# EAGLE design SW4B_QWIIC (EAGLE 9.6.2)
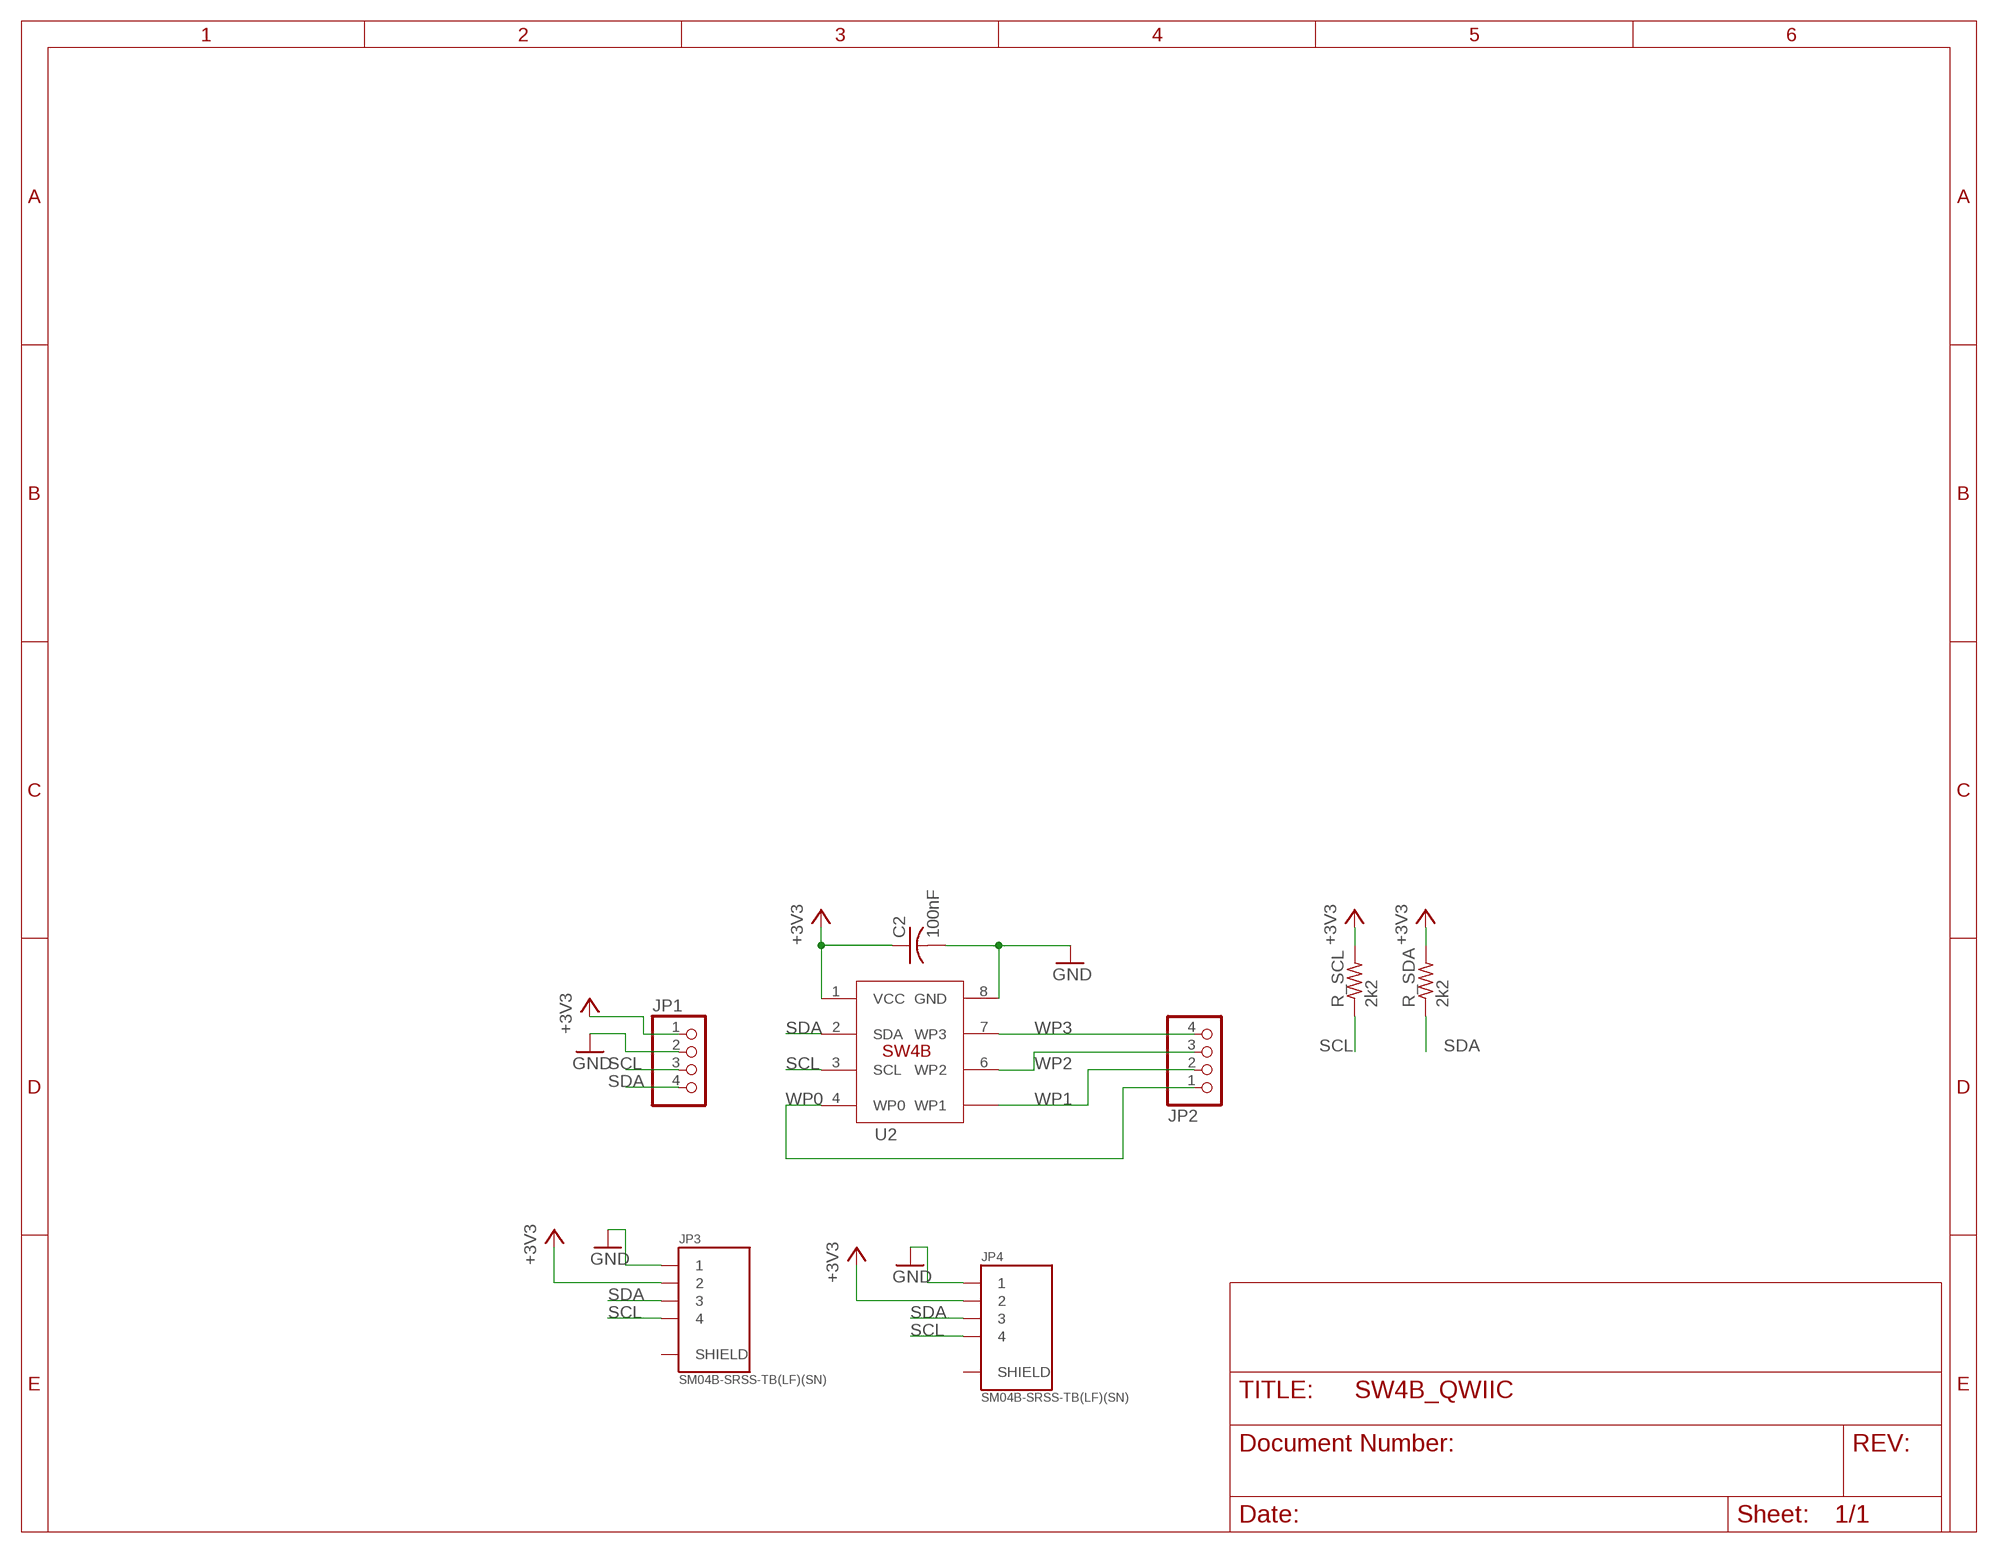
[diagram p0: schematic, sheet 1]

## Parts
C2  100nF  C-USC0603  [C0603]
JP1  PINHD-1X4  [1X04]
JP2  PINHD-1X4  [1X04]
JP3  SM04B-SRSS-TB(LF)(SN)  [JST_SM04B-SRSS-TB(LF)(SN)]
JP4  SM04B-SRSS-TB(LF)(SN)  [JST_SM04B-SRSS-TB(LF)(SN)]
R_SCL  2k2  R-US_R0603  [R0603]
R_SDA  2k2  R-US_R0603  [R0603]
U2  SERIALWOMBAT_4BSOCKETDIP  [SW4B_SOCKET]

## Nets
+3V3: C2.1 JP1.1 JP3.2 JP4.2 R_SCL.2 R_SDA.2 U2.1(VCC)
GND: C2.2 JP1.2 JP3.1 JP4.1 U2.8(GND)
SCL: JP1.3 JP3.4 JP4.4 R_SCL.1 U2.3(SCL)
SDA: JP1.4 JP3.3 JP4.3 R_SDA.1 U2.2(SDA)
WP0: JP2.1 U2.4(WP0)
WP1: JP2.2 U2.5(WP1)
WP2: JP2.3 U2.6(WP2)
WP3: JP2.4 U2.7(WP3)
Unconnected: JP3.S1(SHIELD) JP3.S2(SHIELD) JP4.S1(SHIELD) JP4.S2(SHIELD)

## Library data of the parts
C2 = rcl:C-US: CAPACITOR, American symbol; SPICEPREFIX: C
JP1 JP2 = pinhead:PINHD-1X4: PIN HEADER
JP3 JP4 = SerialWombat_F360_Library:SM04B-SRSS-TB(LF)(SN): SH Series 1.0 mm Pitch 2 Position Single Row Side Entry Shrouded Header; MANUFACTURER: JST; STANDARD: Manufacturer recommendations
R_SCL R_SDA = rcl:R-US_: RESISTOR, American symbol; SPICEPREFIX: R
U2 = SerialWombat_F360_Library:SERIALWOMBAT_4B

## Board
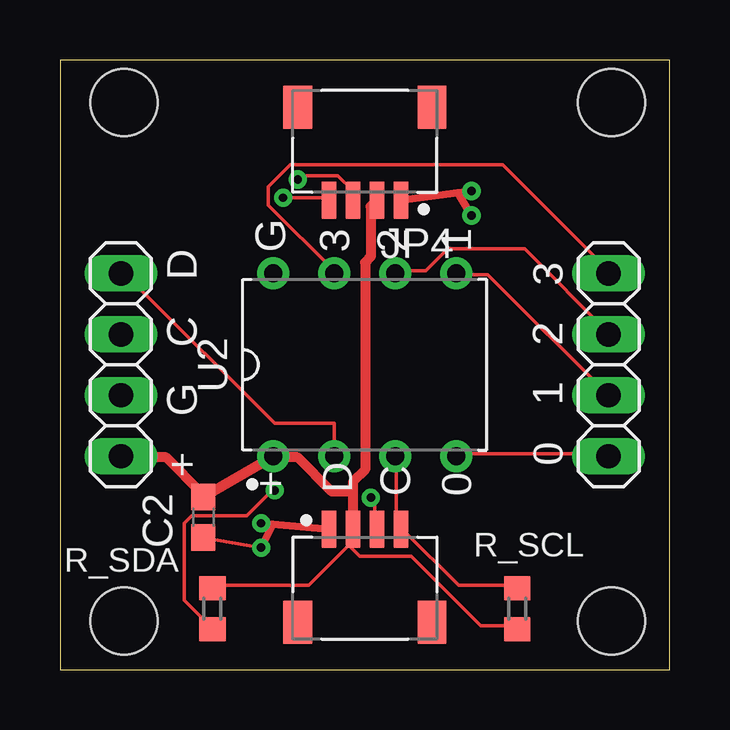
[diagram p1: board, top side]
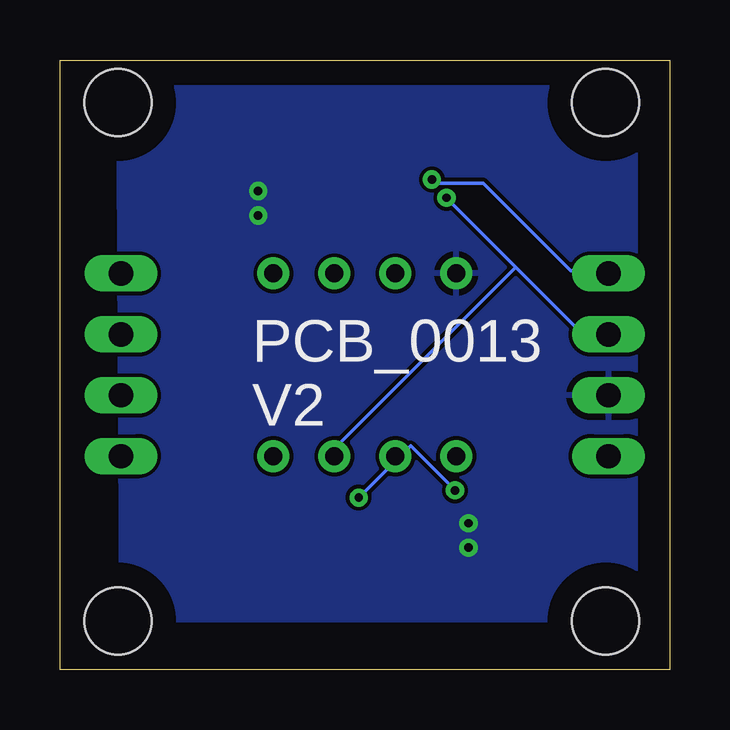
[diagram p2: board, bottom side, seen from below]

Size 25.4 x 25.4 mm. Coordinates in mm from the lower left corner, seen from the top.
Outline: 0,0 25.4,0 25.4,25.4 0,25.4 0,0
Copper layers (1*16): Top 0.035mm / dielectric 1.5mm / Bottom 0.035mm
Design rules "default": minimum track width 6mil, minimum drill 0.35mm, track to track 6mil, track to pad 6mil, pad to pad 6mil, via to via 6mil, smd to smd 6mil, copper to edge 40mil, drill to drill 6mil, minimum pad ring 10mil, minimum via ring 8mil, stop-mask expansion 4mil, vias tented up to drill 0mil, thermal gap 10mil
Holes 2.79 mm at 2.67,23.62 22.99,23.62 22.99,2.03 2.67,2.03

### Footprints (pad centres in the part's own frame; a part is rotated, then mirrored left to right if it is on the bottom)
C0603 = smd 1.1 x 1: 1 -0.85,0; 2 0.85,0
1X04 = drill 1.016 long: 1 -3.81,0; 2 -1.27,0; 3 1.27,0; 4 3.81,0
JST_SM04B-SRSS-TB(LF)(SN) = smd 0.6 x 1.55: 1 -1.5,0; 2 -0.5,0; 3 0.5,0; 4 1.5,0 | smd 1.2 x 1.8: S1 -2.8,-3.875; S2 2.8,-3.875
R0603 = smd 1 x 1.1: 1 -0.85,0; 2 0.85,0
SW4B_SOCKET = drill 0.743 pad 1.343: 1 -3.81,3.81; 2 -3.81,1.27; 3 -3.81,-1.27; 4 -3.81,-3.81; 5 3.81,-3.81; 6 3.81,-1.27; 7 3.81,1.27; 8 3.81,3.81

### Placement (x,y rotation side)
C2  5.97,6.35 270 top
JP1  2.54,12.7 90 top
JP2  22.86,12.7 90 top
JP3  12.7,5.84 0 top
JP4  12.7,19.56 180 top
R_SCL  19.05,2.54 270 top
R_SDA  6.35,2.54 90 top
U2  12.7,12.7 90 top

### Tracks (layer width: path | path; a pad name or v marks a point on that pad's centre or on a via)
+3V3
  Top 0.152: 2.59,8.84 JP1.1 | 5.94,7.32 C2.1 | 12.04,5.18 10.36,3.5 6.4,3.5 R_SDA.2 | 12.04,5.18 12.04,5.79 JP3.2 12.04,5.18 | 12.04,5.18 12.5,4.72 14.63,4.72 17.53,1.83 19.05,1.83 R_SCL.2 | 8.99,8.84 U2.1
  Top 0.406: JP4.2 12.95,19.3 12.95,17.19 12.71,16.96 12.71,8.34 12.2,7.83 12.2,7.42 | 12.2,7.42 JP3.2 | C2.1 U2.1 | 2.59,8.84 4.42,8.84 5.94,7.32 | 8.99,8.84 9.91,8.84 11.33,7.42 12.2,7.42
GND  (via drill 0.35)
  Top 0.152: C2.2 v8.38,5.08
  Top 0.305: JP3.1 8.86,6.05 | 8.86,6.05 v8.38,6.1 | 8.86,6.05 v8.38,5.08 | JP4.1 16.57,19.86 | 16.57,19.86 v17.14,19.94 | 16.57,19.86 v17.14,18.92
  pour Bottom: 1.4,24.89 22.99,24.89 22.86,2.03 1.4,2.03
SCL  (via drill 0.35)
  Top 0.152: R_SCL.1 19.05,3.5 16.61,3.5 14.33,5.79 JP3.4 14.17,5.94 14.02,6.1 14.02,8.84 U2.3 | v9.3,19.66 11.12,19.66 JP4.4
  Bottom 0.152: 6.4,16.76 3.66,14.02 2.59,14.02 JP1.3 | 6.4,16.76 v9.3,19.66 | 6.4,16.76 13.87,9.3 13.87,8.99 U2.3
SDA  (via drill 0.35)
  Top 0.152: v8.94,7.47 8.84,7.47 7.77,6.4 5.49,6.4 5.18,6.1 5.18,2.9 6.25,1.83 R_SDA.1 | v12.95,7.16 13.11,7.01 13.11,5.94 JP3.3 | v9.91,20.42 10.06,20.57 11.58,20.57 12.19,19.96 12.19,19.66 JP4.3 | U2.2 11.43,10.26 8.94,10.26 3.01,16.19 2.71,16.34 JP1.4
  Bottom 0.152: v8.94,7.47 10.79,9.32 11.43,8.69 | 11.43,8.69 U2.2 11.43,8.84 | 11.43,8.69 v12.95,7.16 | v9.91,20.42 9.75,20.27 7.77,20.27 4.12,16.61 2.59,16.61 JP1.4
WP0
  Top 0.152: U2.4 16.61,8.99 22.86,8.99 JP2.1
WP1
  Top 0.152: JP2.2 17.83,16.46 16.61,16.46 U2.5
WP2
  Top 0.152: U2.6 14.02,16.61 15.24,16.61 16.15,17.53 19.36,17.53 22.86,14.02 JP2.3
WP3
  Top 0.152: U2.7 11.43,16.61 8.69,19.36 8.69,20.12 9.6,21.03 18.44,21.03 22.86,16.61 JP2.4

### Text on the board
tPlace: + G C D | 0 1 2 3
bPlace: PCB_0013 / V2